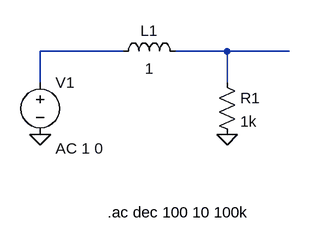
[diagram p0: schematic RL_low_pass.asc]
RL_low_pass.asc, the LTspice schematic file:
Version 4
SHEET 1 880 680
WIRE 384 256 256 256
WIRE 544 256 464 256
WIRE 640 256 544 256
WIRE 256 304 256 256
WIRE 544 304 544 256
FLAG 256 384 0
FLAG 544 384 0
SYMBOL voltage 256 288 R0
WINDOW 123 24 118 Left 2
SYMATTR InstName V1
SYMATTR Value ""
SYMATTR Value2 AC 1 0
SYMBOL ind 368 272 R270
WINDOW 0 32 56 VTop 2
WINDOW 3 5 56 VBottom 2
SYMATTR InstName L1
SYMATTR Value 1
SYMBOL Res 528 288 R0
SYMATTR InstName R1
SYMATTR Value 1k
TEXT 360 504 Left 2 !.ac dec 100 10 100k

The netlist it stands for:
* RL_low_pass.asc
V1 N001 0 AC 1 0
L1 N001 N002 1
R1 N002 0 1k
.ac dec 100 10 100k
.backanno
.end